# Altium schematic sheet Controller.SchDoc
size A4; SheetNumber: 3; SheetTotal: 4
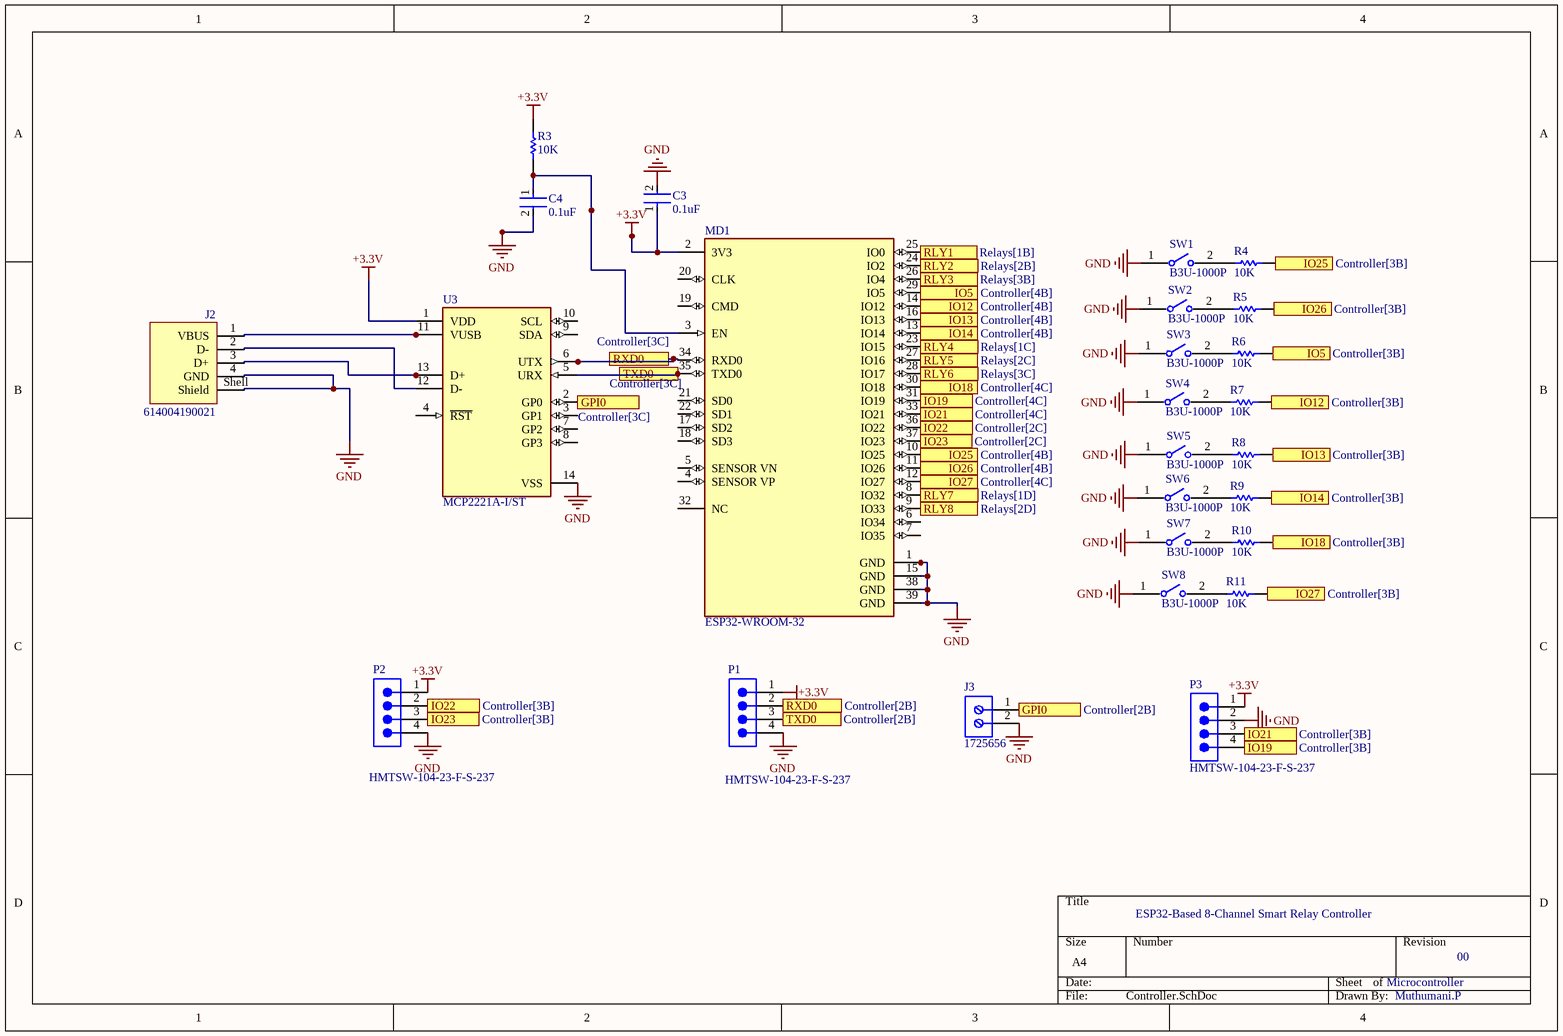
[diagram p0: Controller.SchDoc]

## Parts
C3  0.1uF  [FP-C1206C-EB-MFG]
C4  0.1uF  [FP-C1206C-EB-MFG]
J2  614004190021  [614004190021]
J3  1725656  [PHOE-1725656-2]
MD1  ESP32-WROOM-32  [FP-ESP32-WROOM-32-MFG]
P1  HMTSW-104-23-F-S-237  [SMTC-HMTSW-104-23-X-S-237]
P2  HMTSW-104-23-F-S-237  [SMTC-HMTSW-104-23-X-S-237]
P3  HMTSW-104-23-F-S-237  [SMTC-HMTSW-104-23-X-S-237]
R3  10K  [RESC2013X60X35NL10T20]
R4  10K  [RESC2013X60X35NL10T20]
R5  10K  [RESC2013X60X35NL10T20]
R6  10K  [RESC2013X60X35NL10T20]
R7  10K  [RESC2013X60X35NL10T20]
R8  10K  [RESC2013X60X35NL10T20]
R9  10K  [RESC2013X60X35NL10T20]
R10  10K  [RESC2013X60X35NL10T20]
R11  10K  [RESC2013X60X35NL10T20]
SW1  B3U-1000P  [FP-B3U-1000P-MFG]
SW2  B3U-1000P  [FP-B3U-1000P-MFG]
SW3  B3U-1000P  [FP-B3U-1000P-MFG]
SW4  B3U-1000P  [FP-B3U-1000P-MFG]
SW5  B3U-1000P  [FP-B3U-1000P-MFG]
SW6  B3U-1000P  [FP-B3U-1000P-MFG]
SW7  B3U-1000P  [FP-B3U-1000P-MFG]
SW8  B3U-1000P  [FP-B3U-1000P-MFG]
U3  MCP2221A-I/ST  [FP-C04-087-IPC_B]

## Ports
GPI0 (see Controller[2B]), GPI0 (see Controller[3C]), IO5 (in, see Controller[3B]), IO5 (in, see Controller[4B]), IO12 (in, see Controller[3B]), IO12 (in, see Controller[4B]), IO13 (in, see Controller[3B]), IO13 (in, see Controller[4B]), IO14 (in, see Controller[3B]), IO14 (in, see Controller[4B]), IO18 (in, see Controller[3B]), IO18 (in, see Controller[4C]), IO19 (see Controller[3B]), IO19 (see Controller[4C]), IO21 (see Controller[3B]), IO21 (see Controller[4C]), IO22 (see Controller[2C]), IO22 (see Controller[3B]), IO23 (see Controller[2C]), IO23 (see Controller[3B]), IO25 (in, see Controller[3B]), IO25 (in, see Controller[4B]), IO26 (in, see Controller[3B]), IO26 (in, see Controller[4B]), IO27 (in, see Controller[3B]), IO27 (in, see Controller[4C]), RLY1 (see Relays[1B]), RLY2 (see Relays[2B]), RLY3 (see Relays[3B]), RLY4 (see Relays[1C]), RLY5 (see Relays[2C]), RLY6 (see Relays[3C]), RLY7 (see Relays[1D]), RLY8 (see Relays[2D]), RXD0 (see Controller[2B]), RXD0 (see Controller[3C]), TXD0 (see Controller[2B]), TXD0 (see Controller[3C])

## Nets
+3.3V: C3.1 MD1.2(3V3) P1.1 P2.1 P3.1 R3.2 U3.1(VDD)
GND: C3.2 C4.2 J2.4(GND) J2.Shell(Shield) J3.2 MD1.1(GND) MD1.15(GND) MD1.38(GND) MD1.39(GND) P1.4 P2.4 P3.2 SW1.1 SW2.1 SW3.1 SW4.1 SW5.1 SW6.1 SW7.1 SW8.1 U3.14(VSS)
GPI0: J3.1 U3.2(GP0) ; port GPI0
IO5: MD1.29(IO5) R6.1 ; port IO5
IO12: MD1.14(IO12) R7.1 ; port IO12
IO13: MD1.16(IO13) R8.1 ; port IO13
IO14: MD1.13(IO14) R9.1 ; port IO14
IO18: MD1.30(IO18) R10.1 ; port IO18
IO19: MD1.31(IO19) P3.4 ; port IO19
IO21: MD1.33(IO21) P3.3 ; port IO21
IO22: MD1.36(IO22) P2.2 ; port IO22
IO23: MD1.37(IO23) P2.3 ; port IO23
IO25: MD1.10(IO25) R4.1 ; port IO25
IO26: MD1.11(IO26) R5.1 ; port IO26
IO27: MD1.12(IO27) R11.1 ; port IO27
RLY1: MD1.25(IO0) ; port RLY1
RLY2: MD1.24(IO2) ; port RLY2
RLY3: MD1.26(IO4) ; port RLY3
RLY4: MD1.23(IO15) ; port RLY4
RLY5: MD1.27(IO16) ; port RLY5
RLY6: MD1.28(IO17) ; port RLY6
RLY7: MD1.8(IO32) ; port RLY7
RLY8: MD1.9(IO33) ; port RLY8
RXD0: MD1.34(RXD0) P1.2 U3.6(UTX) ; port RXD0
TXD0: MD1.35(TXD0) P1.3 U3.5(URX) ; port TXD0
NetC4_1: C4.1 MD1.3(EN) R3.1
NetJ2_1: J2.1(VBUS) U3.11(VUSB)
NetJ2_2: J2.2(D-) U3.12(D-)
NetJ2_3: J2.3(D+) U3.13(D+)
NetR4_2: R4.2 SW1.2
NetR5_2: R5.2 SW2.2
NetR6_2: R6.2 SW3.2
NetR7_2: R7.2 SW4.2
NetR8_2: R8.2 SW5.2
NetR9_2: R9.2 SW6.2
NetR10_2: R10.2 SW7.2
NetR11_2: R11.2 SW8.2

Not connected (* = marked no-connect by the designer): MD1 4(SENSOR_VP) 5(SENSOR_VN) 6(IO34) 7(IO35) 17(SD2) 18(SD3) 19(CMD) 20(CLK) 21(SD0) 22(SD1) 32(NC); U3 3(GP1) 4(~{RST}) 7(GP2) 8(GP3) 9(SDA) 10(SCL)

## Notes on the sheet
- ESP32-Based 8-Channel Smart Relay Controller
- Microcontroller
- 00
- Muthumani.P

## Library data of the parts
C3 C4 = CMP-03020-032951-1: C1206 0.22 μF X7R 5.00% 50 V; Manufacturer: KEMET; Manufacturer Part Number: C1206C224J5RAC; Value: 0.22 μF; Material: Ceramic; Tolerance: 0.05; Voltage Rating: 50 V; Automotive Grade: Grade 0; Temperature Coefficient: 15%; Octopart: https://octopart.com/c1206c224j5rac-kemet-1364890; Automotive: Yes; Temperature Characteristic: X7R; Package: C1206C-EB; Device Class L1: Passive Components; Device Class L2: Capacitors; Ipc Land Pattern Name: CAPC320160X78; Temperature: -55°C to +150°C; Mouser Description: Multilayer Ceramic Capacitors MLCC - SMD/SMT 50volts 0.22 uF 5% X7R; Temperature Range Low: -55°C; ComponentLink2URL: https://content.kemet.com/datasheets/KEM_C1007_X8R_ULTRA_150C_SMD.pdf; ComponentLink2Description: Datasheet; Temperature Range High: +150°C; Category: Cap; Height: 0.88mm; Capacitance: 0.22 μF; Device Class L3: Ceramic Capacitors; RoHS: TRUE; Lead Free: Yes
J2 = CMP-1502-03228-3: USB Connector, 2.0 TYPE A, RECEPTACLE, THT; Connector Type: USB Type A; Standard: USB 2.0; Gender: Receptacle; No. of...; USB Standard: USB 2.0; Insulation Resistance: 1GΩ; Current Rating: 3A; Number of Contacts: 4; Operating Supply Voltage: 30V; Contact Resistance: 30mΩ; Housing Color: White; Contact Material: Brass; Orientation: Horizontal; Connector Type: USB; Max Operating Temperature: 85°C; Contact Plating: Gold; Number of Pins: 4; REACH SVHC: No; Insulation Material: PBT; Min Operating Temperature: -40°C; Mount: Horizontal, Through Hole; RoHS: Compliant
J3 = CMP-2000-05299-1: Male Header, Pitch 2.54 mm, 1 x 2 Position, Height 9 mm, Tail Length 3.5 mm; Manufacturer: Phoenix Contact; Number of contacts: 2; Content: 250pc(s); Pitch: 2.54mm; Industrial packaging: Yes; Colour: Green; Manufacturer part No.: 1725656; Type: MPT0,5/2-2,54; Datasheet URL: http://datasheet.octopart.com/1725656-Phoenix-Contact-datasheet-5302866.pdf; Manufacturer URL: http://www.phoenixcontact.com/; Datasheet Version: Apr-08
MD1 = CMP-194065-000008-1: RX TXRX MOD WIFI SURFACE MOUNT; Frequency: 2.5GHz; Sensitivity: -98dBm; Operating Supply Voltage: 3.6V; Data Rate: 150Mbps; Weight: 0.088185oz; Package Quantity: 550; Min Operating Temperature: -40°C; Mount: Surface Mount; Max Operating Temperature: 85°C; Packaging: Cut Tape; Case/Package: SMD/SMT
P1-P3 = CMP-1024-00021-1: Modified .025" SQ Post Header, Through-hole, Vertical, -55 to 125 degC, 2.54 mm Pitch, 4-Pin, Male, RoHS; Manufacturer: Samtec; Pitch: 2.54 mm; PackageReference: HMTSW-104-23-X-S-237; ComponentLink2URL: http://www.samtec.com/documents/webfiles/pdf/HMTSW.PDF; ComponentLink3Description: Package Specification; PartNumber: HMTSW-104-23-F-S-237; RoHS: True; ComponentLink2Description: Datasheet; Temperature Range: -55 to 125 degC; ComponentLink1Description: Manufacturer URL; DatasheetVersion: F-214; PackageDescription: Assembly .025 [.64] SQ. Post Hi-Temp Terminal Strip; Orientation: Vertical; PackageVersion: AL, 3/1987; Mounting Technology: Through-hole; ComponentLink1URL: http://www.samtec.com; ComponentLink3URL: http://www.samtec.com/documents/webfiles/cpdf/HMTSW-XXX-XX-X-X-XXXX-XX-XX-MKT1.pdf
R3-R11 = CMP-1659-00013-4: Chip Resistor, 10 KOhm, +/- 1%, 0.125 W, -55 to 155 degC, 0805 (2012 Metric), RoHS, Tape and Reel; Manufacturer: Yageo; Voltage Rating: 150 V; Mount: Surface Mount; ComponentLink1Description: Manufacturer URL; ComponentLink2URL: http://www.yageo.com/documents/recent/PYu-RC_Group_51_RoHS_L_04.pdf; Pins: 2; Length: 2 mm; Min Operating Temperature: -55 degC; Height: 0.5 mm; Mounting Technology: Surface Mount; RoHSCompliant: true; REACH SVHC: No SVHC; ComponentLink1URL: http://www.yageo.com/; Max Operating Temperature: 155 degC; PackageReference: 0805; DatasheetVersion: Rev. 4, 02/2016; Package Quantity: 5000; Packaging: Tape and Reel; ComponentLink2Description: Datasheet; PackageDescription: 2-Pin Surface Mounted Device, Body 2 x 1.25 mm
SW1-SW8 = CMP-2100-03586-2: SWITCH TACTILE SPST-NO 0.05A 12V; Contact Resistance: 100mR; Operating Force: 1.5N; Max Current Rating: 50mA; Switch Travel: 0.15mm; Actuator Type: Standard; Mechanical Life: 200000Cycles; Ratings: Dust Proof; Illumination Type: Non-Illuminated; Throw Configuration: SPST; Actuator Length: 0.4mm; Switch Function: Off-Mom; Height: 1.2mm; Width: 3mm; Weight: 0.000776oz; Contact Material: Silver; Max Voltage Rating (DC): 12V; Insulation Resistance: 100MR; Lead Free: Lead Free; Current Rating: 50mA; Termination: SMD/SMT; Length: 4mm; Voltage Rating (DC): 12V; Contact Current Rating: 50mA; Orientation: Straight; Depth: 2.5mm; Max Operating Temperature: 70°C; Packaging: Tape and Reel; Min Operating Temperature: -25°C; Package Quantity: 1; Mount: Surface Mount; Electrical Life: 200000Cycles
U3 = CMP-06284-000021-1: IC USB TO I2C/UART 14TSSOP; Interface: I2C; Operating Supply Current: 13mA; Packaging: Rail/Tube; Case/Package: TSSOP; Max Operating Temperature: 85°C; RoHS Compliant: Yes; Min Operating Temperature: -40°C